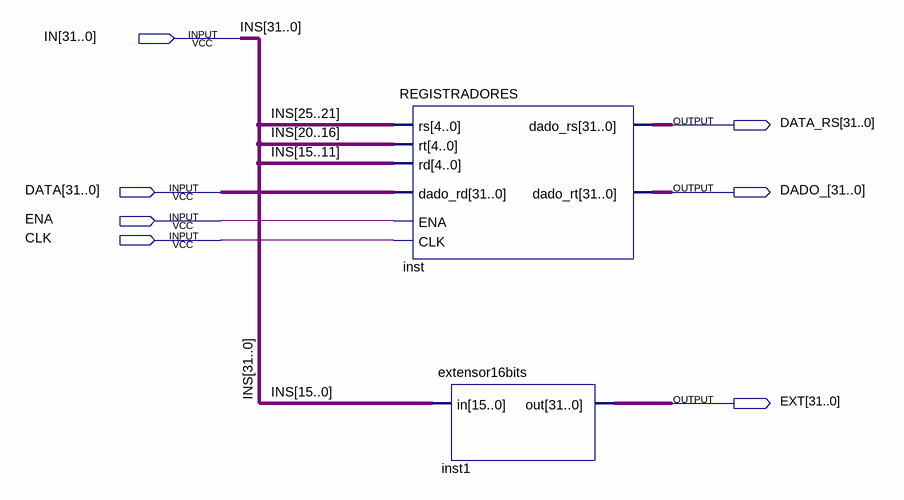
[diagram p0: schematic sheet]
// Quartus schematic TESTE.bdf as structural Verilog: 2 symbols, 7 pins
module TESTE (
  input  [31:0] IN,
  input  [31:0] DATA,
  input  ENA,
  input  CLK,
  output [31:0] DATA_RS,
  output [31:0] DADO_,
  output [31:0] EXT
);

  REGISTRADORES inst (
    .CLK(CLK), .ENA(ENA), .rs(IN[25:21]), .rd(IN[15:11]), .dado_rd(DATA), .rt(IN[20:16]), .dado_rs(DATA_RS),
    .dado_rt(DADO_));
  extensor16bits inst1 (.in(IN[15:0]), .out(EXT));

  // Other names for the same wires on the sheet: INS[31:0] = IN
endmodule
